# Altium schematic sheet Power - 1V2.SchDoc
size A4
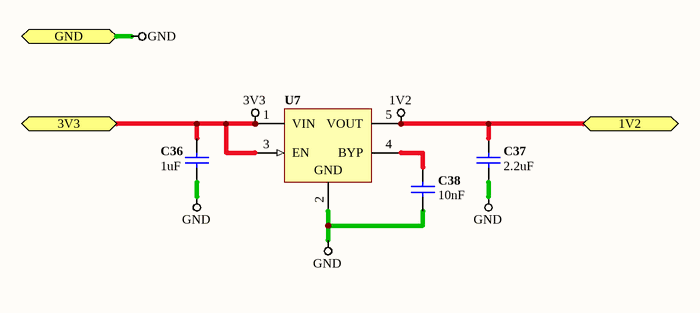
[diagram p0: Power - 1V2.SchDoc]

## Parts
C36  value 1uF  [CAPC0402(1005)60_L]  (hidden comment: CAP 1uF 16V 0402(1005))
C37  value 2.2uF  [CAPC0603(1608)55_L]  (hidden comment: CAP 2.2uF 16V 0603(1608))
C38  value 10nF  [CAPC0402(1005)33_L]  (hidden comment: CAP 10nF 16V 0402(1005))
U7  CAT6219-125TDGT3  [ONSC-SOT23-5_M]  (value not drawn)

## Ports
1V2, 3V3, GND

## Nets
1V2: C37.2 U7.5(VOUT) ; port 1V2
3V3: C36.2 U7.1(VIN) U7.3(EN) ; port 3V3
GND: C36.1 C37.1 C38.1 U7.2(GND) ; port GND
NetC38_2: C38.2 U7.4(BYP)

## Library data of the parts
C36 = CMP-1034-02119-1: CAP 1uF 16V ±10% 0402 (1005 Metric) Thickness 0.6mm SMD; Manufacturer_PN: C1005X5R1C105K050BC; Case-EIA: 0402; Case-Metric: 1005; Technology: SMT; Rated Voltage: 16 V; Tolerance: ±10%; Max Thickness: 0.6 mm; Manufacturer Part Number: C1005X5R1C105K050BC
C37 = CMP-1035-02762-1: CAP 2.2uF 16V ±10% 0603 (1608 Metric) Thickness 0.55mm SMD; Manufacturer_PN: C0603C225K4PACTU; Case-EIA: 0603; Case-Metric: 1608; Max Thickness: 0.55 mm; Technology: SMT; Rated Voltage: 16 V; Tolerance: ±10%; Manufacturer Part Number: C0603C225K4PACTU
C38 = CMP-1034-01875-1: CAP 10nF 16V ±10% 0402 (1005 Metric) Thickness 0.33mm SMD; Manufacturer_PN: GRM155R61C103KA01D; Case-EIA: 0402; Case-Metric: 1005; Max Thickness: 0.33 mm; Tolerance: ±10%; Rated Voltage: 16 V; Technology: SMT; Manufacturer Part Number: GRM155R61C103KA01D
U7 = CAT6219-125TDGT3: Fixed Low Drop Positive Voltage Regulator, 1.2V 5-Pin TSOT-23, Tape and Reel; PartNumber: CAT6219-330TDGT3; Manufacturer: ON Semiconductor; Io Typ(A): 0.5; VDO Typ (V): 0.3; Noise (ÂµVrms): 45; Vo(V): 1.25; Iq Typ (mA): 0.085; PSRR (dB): 64; Output: Single; VI Max (V): 5.5; Mounting Technology: Surface Mount; ComponentLink1URL: http://www.onsemi.com/; DatasheetVersion: Rev. 14; ComponentLink1Description: Manufacturer URL; ComponentLink3URL: http://www.onsemi.com/pub_link/Collateral/419AE.PDF; PackageVersion: Rev. O; PackageDescription: 5-Pin Plastic Small Outline Package, Body 2.9 x 1.6mm, Pitch 0.95mm; Polarity: Positive; Rohs: Pb-free; PackageReference: TSOT-23; ComponentLink3Description: Package Specification; ComponentLink2URL: http://www.onsemi.com/pub_link/Collateral/CAT6219-D.PDF; ComponentLink2Description: Datasheet; Package Type: TSOT-23-5; Manufacturer_PN: CAT6219-330TDGT3; Manufacturer Part Number: CAT6219-330TDGT3